# EAGLE design TromboneTutor (EAGLE 7.2.0)
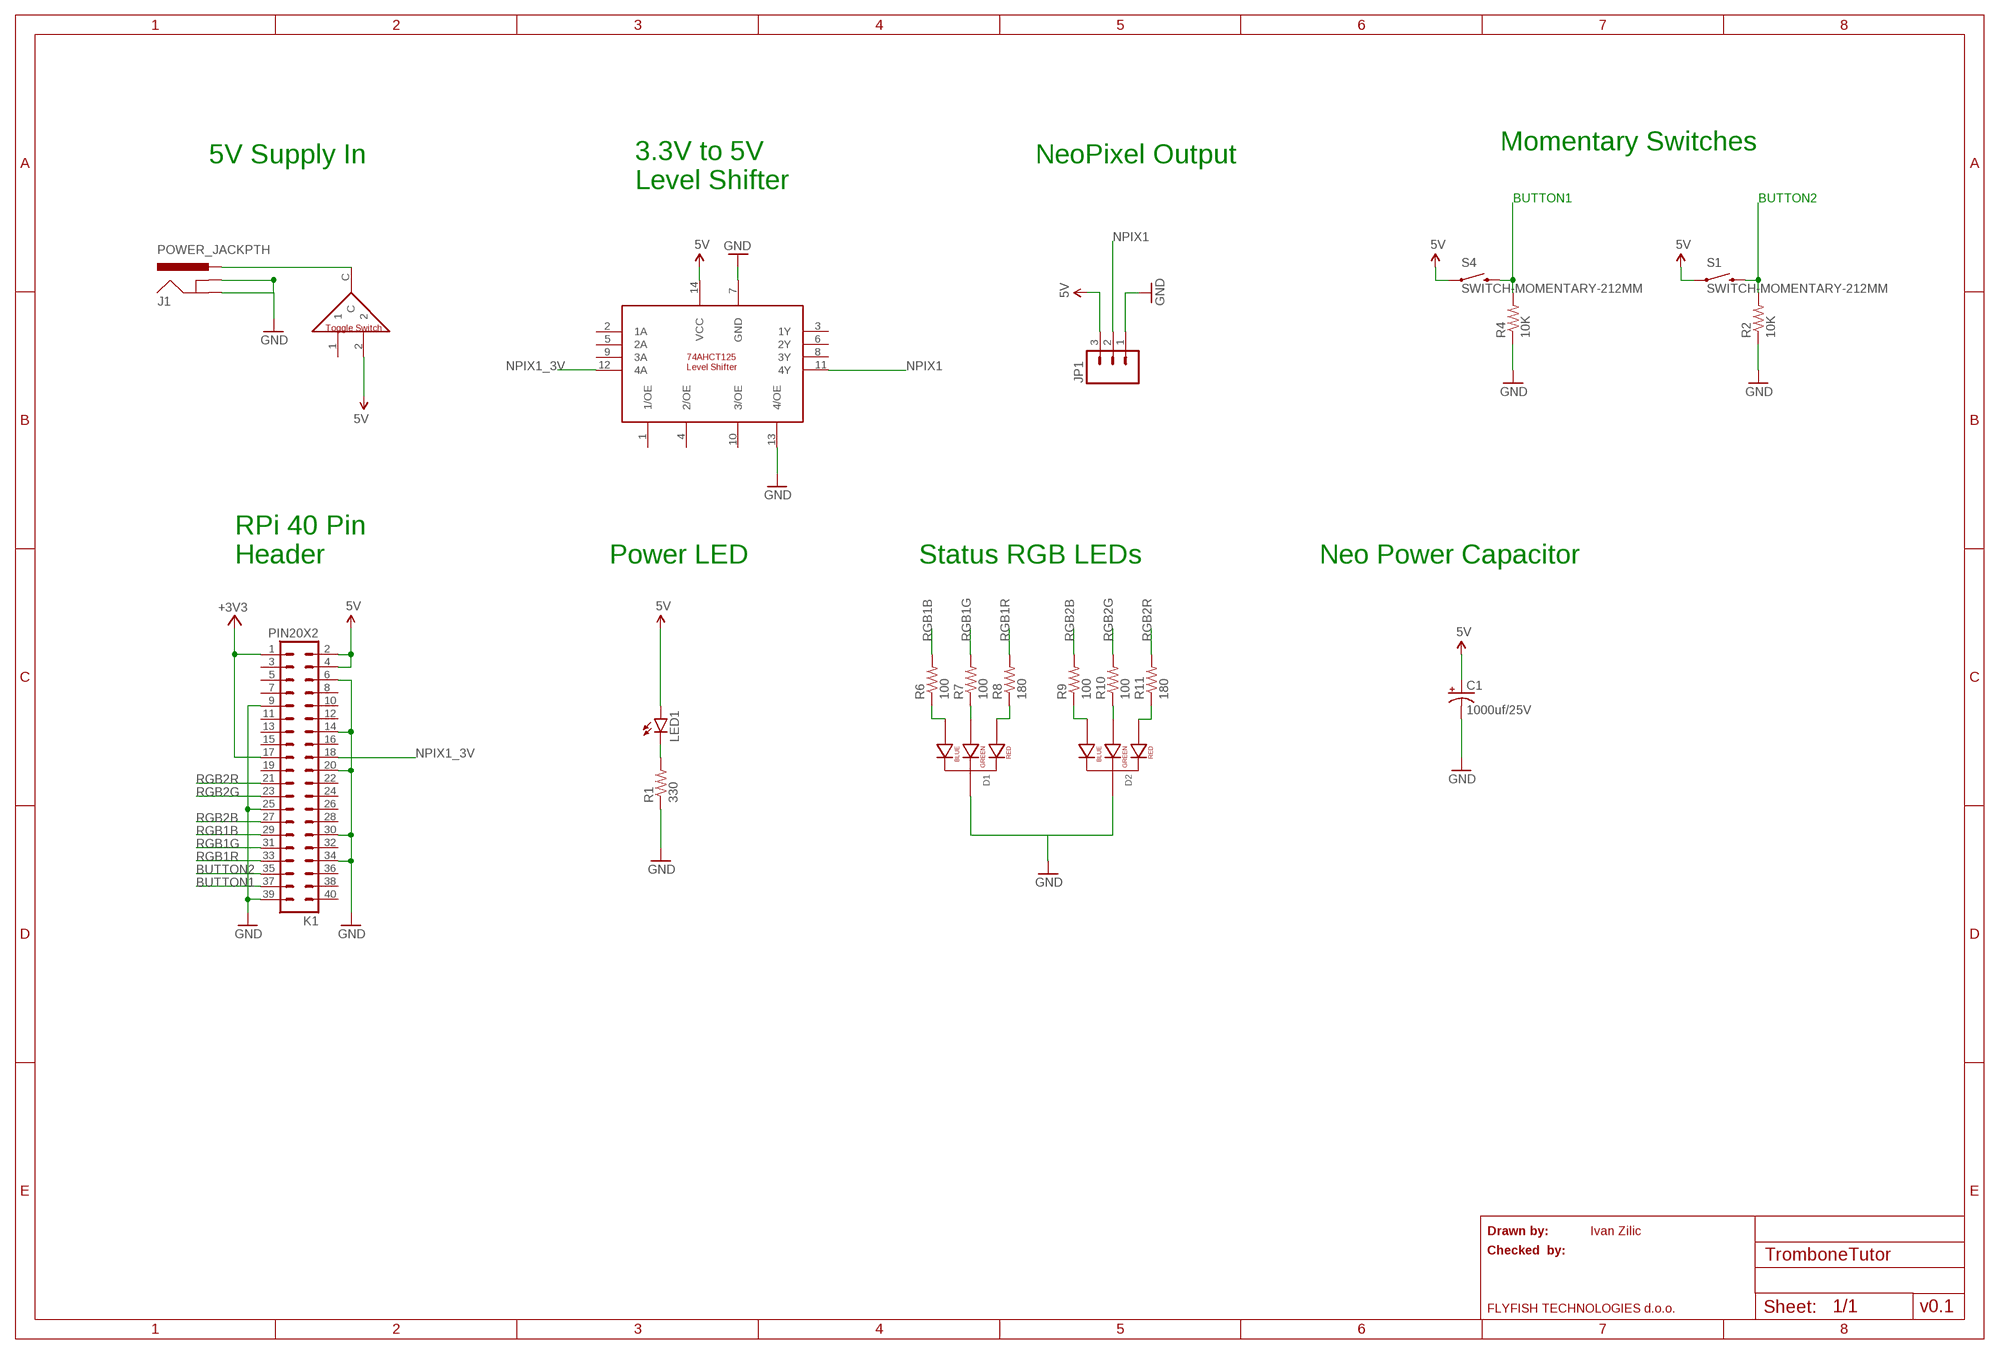
[diagram p0: schematic, sheet 1]

## Parts
C1  1000uf/25V  1000UF-25V(PTH)KIT  [CPOL-RADIAL-1000UF-25V-KIT]
D1  LED-RGB-CC-THRUDIFFUSE  [LED-RGB-THRU]
D2  LED-RGB-CC-THRUDIFFUSE  [LED-RGB-THRU]
J1  POWER_JACKPTH  [POWER_JACK_PTH]
JP1  M03PTH  [1X03]
K1  PIN20X2  [PIN_20X2]
LED1  LED5MM  [LED5MM]
R1  330  RESISTORAXIAL-0.3  [AXIAL-0.3]
R2  10K  RESISTORKIT  [AXIAL-0.3-KIT]
R4  10K  RESISTORKIT  [AXIAL-0.3-KIT]
R6  100  RESISTORAXIAL-0.3  [AXIAL-0.3]
R7  100  RESISTORAXIAL-0.3  [AXIAL-0.3]
R8  180  RESISTORAXIAL-0.3  [AXIAL-0.3]
R9  100  RESISTORAXIAL-0.3  [AXIAL-0.3]
R10  100  RESISTORAXIAL-0.3  [AXIAL-0.3]
R11  180  RESISTORAXIAL-0.3  [AXIAL-0.3]
S1  SWITCH-MOMENTARY-212MM  [TACTILE-PTH-12MM]
S4  SWITCH-MOMENTARY-212MM  [TACTILE-PTH-12MM]
U$1  74AHCT125_LEVELSHIFT  [DIL14]
U$2  TOGGLE_SWITCH_ESTORE  [TOGGLE_SWITCH_ESTORE]

## Nets
5V: C1.+ JP1.3 K1.2 K1.4 LED1.A S1.1 S4.1 U$1.14(VCC) U$2.2
+3V3: K1.1 K1.17
BUTTON1: K1.37 R4.P$2 S4.3
BUTTON2: K1.35 R2.P$2 S1.3
GND: C1.- D1.2(CATHODE) D2.2(CATHODE) J1.GND J1.GNDBREAK JP1.1 K1.6 K1.9 K1.14 K1.20 K1.25 K1.30 K1.34 K1.39 R1.P$1 R2.P$1 R4.P$1 U$1.7(GND) U$1.13(4/OE)
N$1: J1.PWR U$2.C
N$2: D1.4(BLUE_CATHODE) R6.P$1
N$3: D1.3(GREEN_CATHODE) R7.P$1
N$4: D1.1(RED_CATHODE) R8.P$1
N$5: D2.4(BLUE_CATHODE) R9.P$1
N$6: LED1.K(C) R1.P$2
N$7: D2.3(GREEN_CATHODE) R10.P$1
N$8: D2.1(RED_CATHODE) R11.P$1
NPIX1: JP1.2 U$1.11(4Y)
NPIX1_3V: K1.18 U$1.12(4A)
RGB1B: K1.29 R6.P$2
RGB1G: K1.31 R7.P$2
RGB1R: K1.33 R8.P$2
RGB2B: K1.27 R9.P$2
RGB2G: K1.23 R10.P$2
RGB2R: K1.21 R11.P$2
Unconnected: K1.3 K1.5 K1.7 K1.8 K1.10 K1.11 K1.12 K1.13 K1.15 K1.16 K1.19 K1.22 K1.24 K1.26 K1.28 K1.32 K1.36 K1.38 K1.40 U$1.1(1/OE) U$1.2(1A) U$1.3(1Y) U$1.4(2/OE) U$1.5(2A) U$1.6(2Y) U$1.8(3Y) U$1.9(3A) U$1.10(3/OE) U$2.1

## Notes on the sheet
- Momentary Switches
- 5V Supply In | NeoPixel Output
- 3.3V to 5V
  Level Shifter
- RPi 40 Pin
  Header
- Power LED | Status RGB LEDs | Neo Power Capacitor
- Drawn by: | Ivan Zilic
- Checked  by:
- FLYFISH TECHNOLOGIES d.o.o. | v0.1

## Library data of the parts
C1 = Terramus:1000UF-25V(PTH): CAP-08070; PROD_ID: CAP-09538
D1 D2 = SparkFun-LED:LED-RGB-CC-THRU: RGB Through-hole common cathode LED SparkFun Storefront: COM-00105 (Clear) COM-09264 (Diffuse); PROD_ID: DIO-09434
J1 = Terramus:POWER_JACK: Power Jack This is the standard 5.5mm barrel jack for power. The PTH is the most common, proven, reliable, footprint. The Slot footprint only works if the mill layer is transmitted to the PCB fab house so be warned. Mating wall wart : TOL-00298 (and others); PROD_ID: PRT-00119
JP1 = Terramus:M03: Header 3 Standard 3-pin 0.1" header. Use with straight break away headers (SKU : PRT-00116), right angle break away headers (PRT-00553), swiss pins (PRT-00743), machine pins (PRT-00117), and female headers (PRT-00115). Molex polarized connector foot print use with SKU : PRT-08232 with associated crimp pins and housings.
K1 = FLYFISH:PIN20X2
LED1 = SparkFun-LED:LED: LEDs Standard schematic elements and footprints for 5mm, 3mm, 1206, and 0603 sized LEDs. 5mm - Spark Fun Electronics SKU : COM-00529 (and others)
R1 R2 R4 R6-R11 = SparkFun-Resistors:RESISTOR: Resistor Basic schematic elements and footprints for 0603, 1206, and PTH resistors.
S1 S4 = Terramus:SWITCH-MOMENTARY-2: Various NO switches- pushbuttons, reed, etc; PROD_ID: SWCH-09185
U$1 = Terramus:74AHCT125_LEVELSHIFT
U$2 = Terramus:TOGGLE_SWITCH_ESTORE

## Board
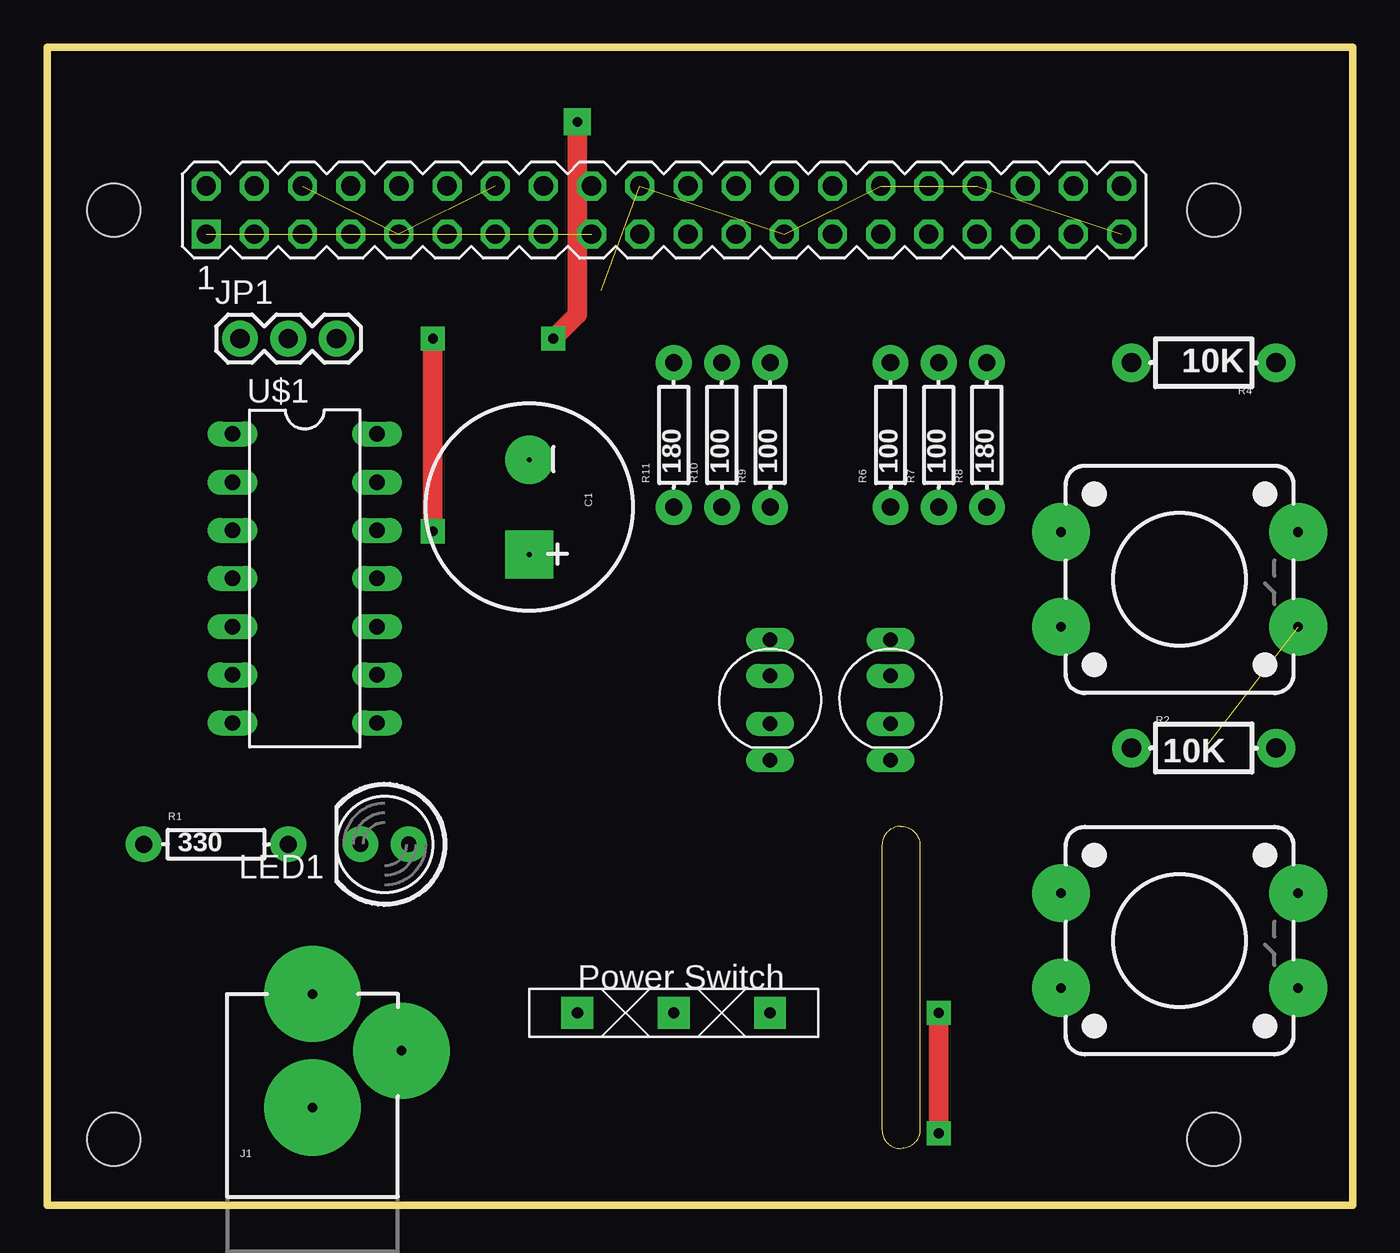
[diagram p1: board, top side]
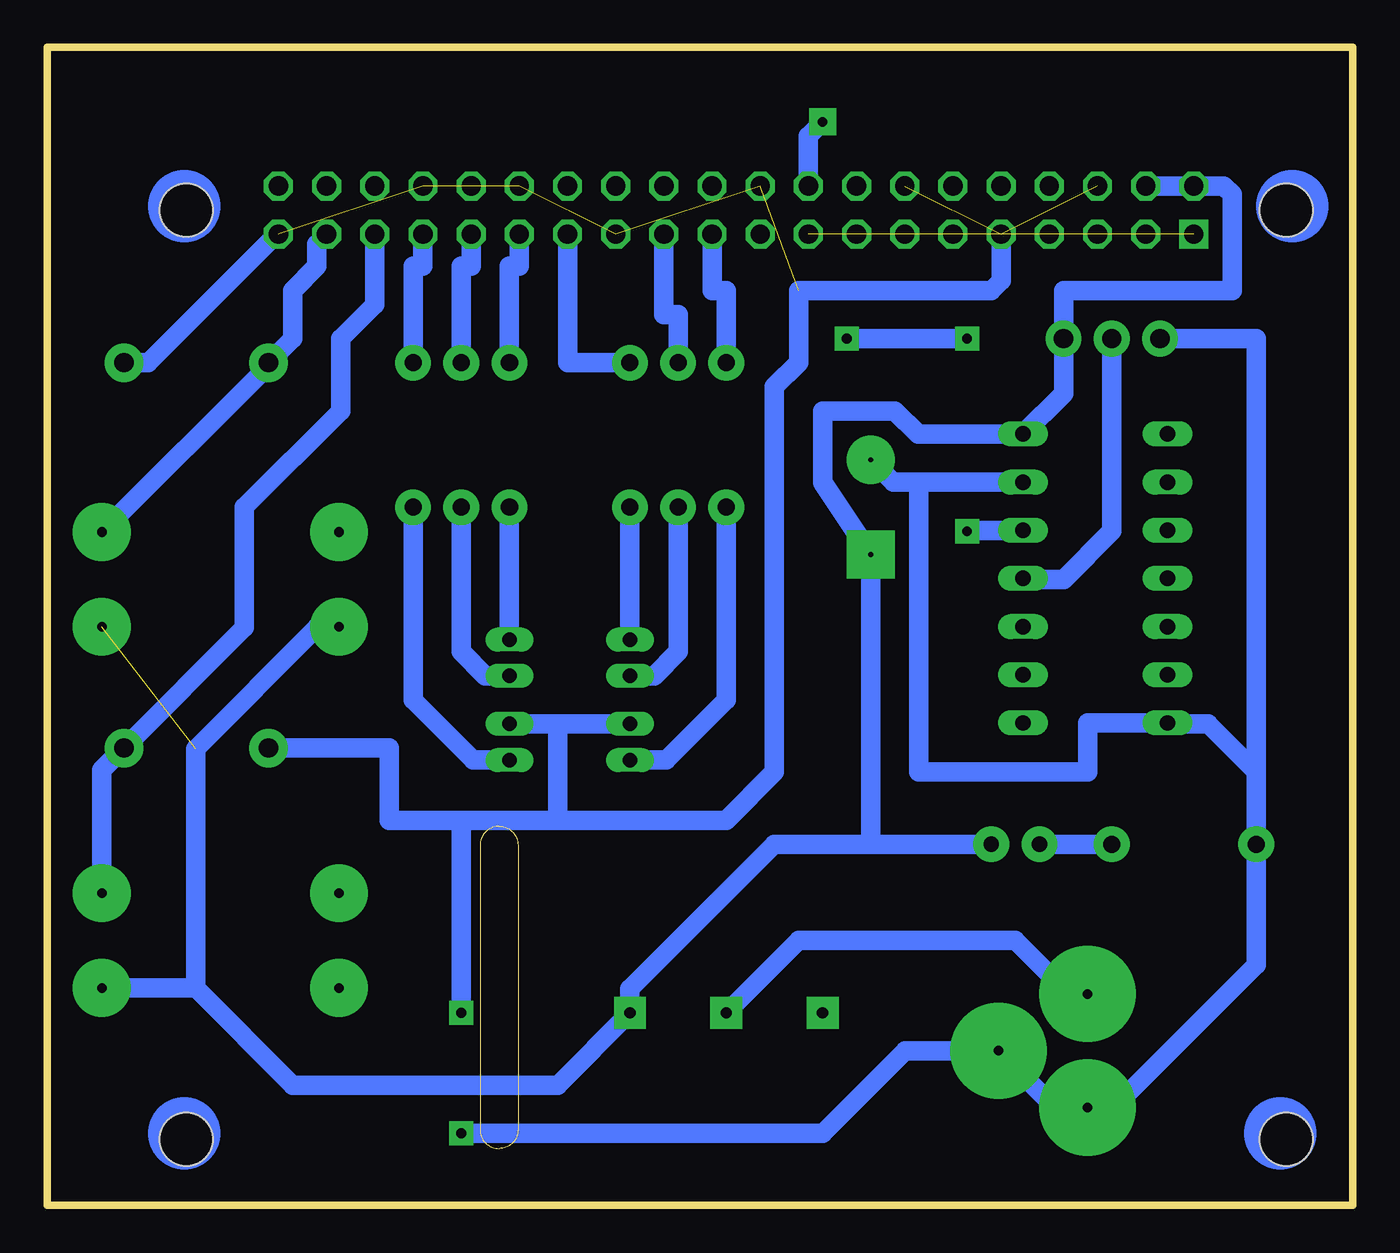
[diagram p2: board, bottom side, seen from below]

Size 68.81 x 61.08 mm. Coordinates in mm from the lower left corner, seen from the top.
Outline: 0,18.5 0,3
Outline: 0,0 68.81,0 68.81,61.08 0,61.08 0,0
Copper layers (1*16): Top 0.035mm / dielectric 1.5mm / Bottom 0.035mm
Design rules "ITEADstudio_DRC": minimum track width 6mil, minimum drill 12mil, track to track 6mil, track to pad 6mil, pad to pad 6mil, via to via 6mil, smd to smd 0mil, copper to edge 10mil, drill to drill 10mil, minimum pad ring 10mil, minimum via ring 6mil, stop-mask expansion 2mil, vias tented up to drill 100mil, thermal gap 10mil
Holes 2.8 mm at 3.5,3.5 3.5,52.5 61.5,52.5 61.5,3.5
tRestrict: area 1.9,51 to 5,54; area 60,51 to 63,54; area 60,1.9 to 63,5; area 1.9,1.9 to 5,5
bRestrict: area 1.9,1.9 to 5,5; area 1.9,51 to 5,54; area 60,1.9 to 63,5; area 60,51 to 63,54
Milling: 6 lines

### Footprints (pad centres in the part's own frame; a part is rotated, then mirrored left to right if it is on the bottom)
CPOL-RADIAL-1000UF-25V-KIT = drill 0.254 pad 2.54 square: + 2.5,0 | drill 0.254 pad 2.54: - -2.5,0
LED-RGB-THRU = drill 0.762 pad 0.889 long: 1 3.175,0; 2 1.27,0; 3 -1.27,0; 4 -3.175,0
POWER_JACK_PTH = drill 0.5 pad 5.08: GND 0,7.7; GNDBREAK 4.7,10.7; PWR 0,13.7
1X03 = drill 1.016 pad 1.88: 1 0,0; 2 2.54,0; 3 5.08,0
PIN_20X2 = drill 1.016 square: 1 -24.13,-1.27 | drill 1.016 octagon: 2 -24.13,1.27; 3 -21.59,-1.27; 4 -21.59,1.27; 5 -19.05,-1.27; 6 -19.05,1.27; 7 -16.51,-1.27; 8 -16.51,1.27; 9 -13.97,-1.27; 10 -13.97,1.27; 11 -11.43,-1.27; 12 -11.43,1.27; 13 -8.89,-1.27; 14 -8.89,1.27; 15 -6.35,-1.27; 16 -6.35,1.27; 17 -3.81,-1.27; 18 -3.81,1.27; 19 -1.27,-1.27; 20 -1.27,1.27; 21 1.27,-1.27; 22 1.27,1.27; 23 3.81,-1.27; 24 3.81,1.27; 25 6.35,-1.27; 26 6.35,1.27; 27 8.89,-1.27; 28 8.89,1.27; 29 11.43,-1.27; 30 11.43,1.27; 31 13.97,-1.27; 32 13.97,1.27; 33 16.51,-1.27; 34 16.51,1.27; 35 19.05,-1.27; 36 19.05,1.27; 37 21.59,-1.27; 38 21.59,1.27; 39 24.13,-1.27; 40 24.13,1.27
LED5MM = drill 0.813 pad 1.88: A -1.27,0; K 1.27,0
AXIAL-0.3 = drill 0.9 pad 1.88: P$1 -3.81,0; P$2 3.81,0
AXIAL-0.3-KIT = drill 1.016 pad 2.032: P$1 -3.81,0; P$2 3.81,0
TACTILE-PTH-12MM = drill 0.508 pad 3.048: 1 6.25,-2.5; 2 -6.25,-2.5; 3 6.25,2.5; 4 -6.25,2.5
DIL14 = drill 0.813 long: 1 -7.62,-3.81; 2 -5.08,-3.81; 3 -2.54,-3.81; 4 0,-3.81; 5 2.54,-3.81; 6 5.08,-3.81; 7 7.62,-3.81; 8 7.62,3.81; 9 5.08,3.81; 10 2.54,3.81; 11 0,3.81; 12 -2.54,3.81; 13 -5.08,3.81; 14 -7.62,3.81
TOGGLE_SWITCH_ESTORE = drill 0.6 pad 1.676 square: 1 -5.08,0; 2 5.08,0; C 0,0

### Placement (x,y rotation side)
C1  25.4,36.83 270 top
D1  44.45,26.67 270 top
D2  38.1,26.67 270 top
J1  13.97,-2.54 0 top
JP1  10.16,45.72 0 top
K1  32.5,52.5 0 top
LED1  17.78,19.05 180 top
R1  8.89,19.05 0 top
R2  60.96,24.13 0 top
R4  60.96,44.45 180 top
R6  44.45,40.64 90 top
R7  46.99,40.64 90 top
R8  49.53,40.64 90 top
R9  38.1,40.64 90 top
R10  35.56,40.64 90 top
R11  33.02,40.64 90 top
S1  59.69,13.97 0 top
S4  59.69,33.02 0 top
U$1  13.57,33.07 270 top
U$2  33.02,10.16 0 top

### Tracks (layer width: path | path; a pad name or v marks a point on that pad's centre or on a via)
5V  (1 unrouted)
  Bottom 1.016: 61,11.47 55.88,6.35 41.91,6.35 U$2.2 38.1,11.43 30.48,19.05 25.4,19.05 | 61,11.47 61,24.09 54.61,30.48 53.34,30.48 | S1.1 61,11.47 | 25.4,19.05 C1.+ 27.94,38.14 27.94,41.91 24.13,41.91 22.91,40.69 U$1.14 15.24,42.83 JP1.3 15.24,48.26 6.35,48.26 6.35,53.34 6.78,53.77 K1.2 K1.4 | LED1.A 25.4,19.05
+3V3  (1 unrouted)
BUTTON1
  Bottom 1.016: K1.37 54.61,50.71 54.61,49.53 55.88,48.26 55.88,45.72 R4.P$2 57.15,44.31 S4.3
BUTTON2
  Bottom 1.016: S1.3 65.94,22.96 R2.P$2 58.42,30.48 58.42,36.83 53.34,41.91 53.34,45.72 51.55,47.51 K1.35
GND  (via drill 0.51 pad 1.27)  (7 unrouted)
  Top 1.016: v46.99,3.81 v46.99,10.16
  Bottom 1.016: D1.2 41.91,25.4 | 41.91,25.4 D2.2 | R2.P$1 50.8,24.13 50.8,20.32 46.99,20.32 | K1.39 56.72,51.23 63.5,44.45 R4.P$1 | 5.08,22.86 R1.P$1 5.08,12.7 12.62,5.16 J1.GND 15.67,5.16 J1.GNDBREAK 23.59,8.16 27.94,3.81 v46.99,3.81 | 5.08,22.86 7.62,25.4 9.71,25.4 U$1.7 13.97,25.45 13.97,22.86 22.86,22.86 22.86,38.15 | U$1.13 22.86,38.15 | 22.86,38.15 24.22,38.15 C1.- | JP1.1 5.08,45.72 5.08,22.86 | v46.99,10.16 46.99,20.32 | K1.9 18.53,48.78 19.05,48.26 29.21,48.26 29.21,44.45 30.48,43.18 30.48,22.86 33.02,20.32 41.91,20.32 | 41.91,25.4 41.91,20.32 | 41.91,20.32 46.99,20.32
N$1
  Bottom 1.016: J1.PWR 14.97,11.16 17.78,13.97 29.21,13.97 U$2.C
N$2
  Bottom 1.016: D1.4 R6.P$1
N$3
  Bottom 1.016: R7.P$1 46.99,29.21 45.72,27.94 D1.3
N$4
  Bottom 1.016: R8.P$1 49.53,26.67 46.35,23.5 D1.1
N$5
  Bottom 1.016: R9.P$1 D2.4
N$6
  Bottom 1.016: LED1.K R1.P$2
N$7
  Bottom 1.016: R10.P$1 35.56,29.21 36.83,27.94 D2.3
N$8
  Bottom 1.016: R11.P$1 33.02,26.67 36.2,23.5 D2.1
NPIX1
  Bottom 1.016: JP1.2 12.7,35.56 15.24,33.02 17.33,33.02 U$1.11
NPIX1_3V  (via drill 0.51 pad 1.27, 0.51 pad 1.42)
  Top 1.016: v27.94,57.15 27.94,46.99 v26.67,45.72 | v20.32,35.56 v20.32,45.72
  Bottom 1.016: K1.18 28.69,56.4 v27.94,57.15 | U$1.12 20.27,35.61 v20.32,35.56 | v20.32,45.72 v26.67,45.72
RGB1B
  Bottom 1.016: K1.29 43.93,49.53 44.45,49.53 R6.P$2
RGB1G
  Bottom 1.016: K1.31 46.47,49.53 46.99,49.53 R7.P$2
RGB1R
  Bottom 1.016: K1.33 49.01,49.53 49.53,49.53 R8.P$2
RGB2B
  Bottom 1.016: R9.P$2 41.39,44.45 K1.27
RGB2G
  Bottom 1.016: K1.23 36.31,46.99 35.56,46.99 R10.P$2
RGB2R
  Bottom 1.016: K1.21 33.77,48.26 33.02,48.26 R11.P$2
(copper drawn outside any net)
  shapes: Bottom circle x4